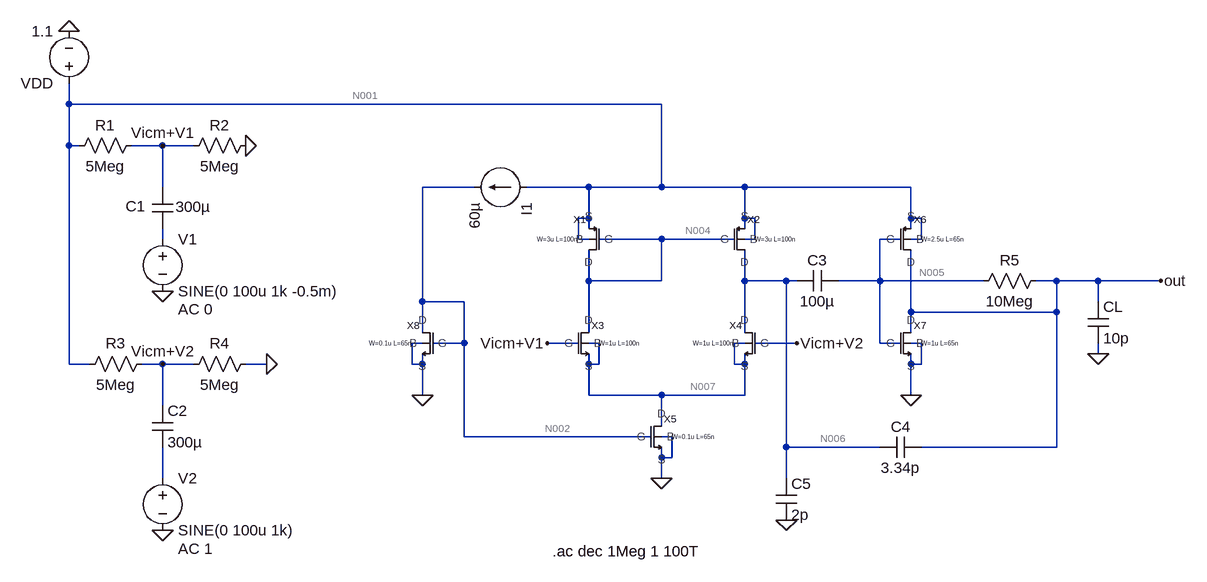
[diagram p0: schematic q1.asc]
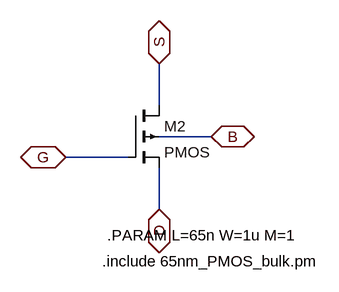
[diagram p1: sub-circuit pmos65.asc]
q1.asc, the LTspice schematic file:
Version 4
SHEET 1 1624 692
WIRE -160 -96 -160 -128
WIRE 752 -96 -160 -96
WIRE -160 -32 -160 -96
WIRE -144 -32 -160 -32
WIRE -16 -32 -64 -32
WIRE 32 -32 -16 -32
WIRE -16 32 -16 -32
WIRE 464 32 384 32
WIRE 640 32 544 32
WIRE 752 32 752 -96
WIRE 752 32 640 32
WIRE 880 32 752 32
WIRE 1136 32 880 32
WIRE 640 80 640 32
WIRE 640 80 624 80
WIRE 880 80 880 32
WIRE 896 80 880 80
WIRE 1136 80 1136 32
WIRE 1152 80 1136 80
WIRE 640 96 640 80
WIRE 880 96 880 80
WIRE 1136 96 1136 80
WIRE -16 112 -16 96
WIRE 624 112 624 80
WIRE 640 112 624 112
WIRE 752 112 656 112
WIRE 864 112 752 112
WIRE 896 112 896 80
WIRE 896 112 880 112
WIRE 1120 112 1088 112
WIRE 1152 112 1152 80
WIRE 1152 112 1136 112
WIRE 640 176 640 128
WIRE 752 176 752 112
WIRE 752 176 640 176
WIRE 880 176 880 128
WIRE 944 176 880 176
WIRE 960 176 944 176
WIRE 1088 176 1088 112
WIRE 1088 176 1024 176
WIRE 1248 176 1088 176
WIRE 1360 176 1328 176
WIRE 1424 176 1360 176
WIRE 1520 176 1424 176
WIRE 384 208 384 32
WIRE 448 208 384 208
WIRE 1424 208 1424 176
WIRE 1136 224 1136 128
WIRE 1360 224 1360 176
WIRE 1360 224 1136 224
WIRE 384 256 384 208
WIRE 640 256 640 176
WIRE 880 256 880 176
WIRE 1136 256 1136 224
WIRE 384 272 368 272
WIRE 448 272 448 208
WIRE 448 272 400 272
WIRE 624 272 576 272
WIRE 656 272 640 272
WIRE 880 272 864 272
WIRE 960 272 896 272
WIRE 1088 272 1088 176
WIRE 1120 272 1088 272
WIRE 1152 272 1136 272
WIRE 1424 288 1424 272
WIRE -160 304 -160 -32
WIRE -128 304 -160 304
WIRE -16 304 -48 304
WIRE 32 304 -16 304
WIRE 144 304 112 304
WIRE 368 304 368 272
WIRE 384 304 384 288
WIRE 384 304 368 304
WIRE 640 304 640 288
WIRE 656 304 656 272
WIRE 656 304 640 304
WIRE 864 304 864 272
WIRE 880 304 880 288
WIRE 880 304 864 304
WIRE 1136 304 1136 288
WIRE 1152 304 1152 272
WIRE 1152 304 1136 304
WIRE 384 352 384 304
WIRE 640 352 640 304
WIRE 752 352 640 352
WIRE 880 352 880 304
WIRE 880 352 752 352
WIRE 1136 352 1136 304
WIRE -16 368 -16 304
WIRE 752 400 752 352
WIRE 448 416 448 272
WIRE 736 416 448 416
WIRE 768 416 752 416
WIRE 944 432 944 176
WIRE 1088 432 944 432
WIRE 1360 432 1360 224
WIRE 1360 432 1152 432
WIRE 752 448 752 432
WIRE 768 448 768 416
WIRE 768 448 752 448
WIRE -16 480 -16 432
WIRE 752 480 752 448
WIRE 944 480 944 432
FLAG 752 480 0
FLAG 1136 352 0
FLAG 1424 288 0
FLAG -16 192 0
FLAG -16 560 0
FLAG 576 272 Vicm+V1
FLAG 960 272 Vicm+V2
FLAG 112 -32 0
FLAG 144 304 0
FLAG -16 -32 Vicm+V1
FLAG -16 304 Vicm+V2
FLAG 384 352 0
FLAG -160 -208 0
FLAG 1520 176 out
FLAG 944 544 0
SYMBOL pmos65 624 112 M0
WINDOW 39 0 0 Left 0
SYMATTR SpiceLine W=3u L=100n
SYMATTR InstName X1
SYMBOL pmos65 896 112 R0
WINDOW 39 0 0 Left 0
SYMATTR SpiceLine W=3u L=100n
SYMATTR InstName X2
SYMBOL nmos65 656 272 R0
WINDOW 39 0 0 Left 0
SYMATTR SpiceLine W=1u L=100n
SYMATTR InstName X3
SYMBOL nmos65 864 272 M0
WINDOW 39 0 0 Left 0
SYMATTR SpiceLine W=1u L=100n
SYMATTR InstName X4
SYMBOL nmos65 768 416 R0
WINDOW 39 0 0 Left 0
SYMATTR SpiceLine W=0.1u L=65n
SYMATTR InstName X5
SYMBOL pmos65 1152 112 R0
WINDOW 39 0 0 Left 0
SYMATTR SpiceLine W=2.5u L=65n
SYMATTR InstName X6
SYMBOL nmos65 1152 272 R0
WINDOW 39 0 0 Left 0
SYMATTR SpiceLine W=1u L=65n
SYMATTR InstName X7
SYMBOL cap 1408 208 R0
SYMATTR InstName CL
SYMATTR Value 10p
SYMBOL voltage -16 96 R0
WINDOW 123 24 124 Left 2
WINDOW 39 0 0 Left 0
SYMATTR Value2 AC 0
SYMATTR InstName V1
SYMATTR Value SINE(0 100u 1k -0.5m)
SYMBOL cap -32 32 R0
WINDOW 0 -41 29 Left 2
WINDOW 3 36 30 Left 2
SYMATTR InstName C1
SYMATTR Value 300µ
SYMBOL res 16 -16 R270
WINDOW 0 32 56 VTop 2
WINDOW 3 0 56 VBottom 2
SYMATTR InstName R2
SYMATTR Value 5Meg
SYMBOL voltage -16 464 R0
WINDOW 123 24 124 Left 2
WINDOW 39 0 0 Left 0
SYMATTR Value2 AC 1
SYMATTR InstName V2
SYMATTR Value SINE(0 100u 1k)
SYMBOL cap -32 368 R0
SYMATTR InstName C2
SYMATTR Value 300µ
SYMBOL res 16 320 R270
WINDOW 0 32 56 VTop 2
WINDOW 3 0 56 VBottom 2
SYMATTR InstName R4
SYMATTR Value 5Meg
SYMBOL res -144 320 R270
WINDOW 0 32 56 VTop 2
WINDOW 3 0 56 VBottom 2
SYMATTR InstName R3
SYMATTR Value 5Meg
SYMBOL res -160 -16 R270
WINDOW 0 32 56 VTop 2
WINDOW 3 0 56 VBottom 2
SYMATTR InstName R1
SYMATTR Value 5Meg
SYMBOL current 544 32 R90
WINDOW 123 0 0 Left 0
WINDOW 39 0 0 Left 0
SYMATTR InstName I1
SYMATTR Value 60µ
SYMBOL nmos65 368 272 M0
WINDOW 39 0 0 Left 0
SYMATTR SpiceLine W=0.1u L=65n
SYMATTR InstName X8
SYMBOL voltage -160 -112 R180
WINDOW 123 0 0 Left 0
WINDOW 39 0 0 Left 0
SYMATTR InstName VDD
SYMATTR Value 1.1
SYMBOL res 1232 192 R270
WINDOW 0 32 56 VTop 2
WINDOW 3 0 56 VBottom 2
SYMATTR InstName R5
SYMATTR Value 10Meg
SYMBOL cap 1024 160 R90
WINDOW 0 0 32 VBottom 2
WINDOW 3 32 32 VTop 2
SYMATTR InstName C3
SYMATTR Value 100µ
SYMBOL cap 1152 416 R90
WINDOW 0 0 32 VBottom 2
WINDOW 3 32 32 VTop 2
SYMATTR InstName C4
SYMATTR Value 3.34p
SYMBOL cap 928 480 R0
SYMATTR InstName C5
SYMATTR Value 2p
TEXT 584 592 Left 2 !.ac dec 1Meg 1 100T

pmos65.asc, the sub-circuit schematic file:
Version 4
SHEET 1 880 680
WIRE 160 80 160 16
WIRE 240 128 160 128
WIRE 112 160 16 160
WIRE 160 240 160 176
FLAG 16 160 G
IOPIN 16 160 BiDir
FLAG 160 240 D
IOPIN 160 240 BiDir
FLAG 160 16 S
IOPIN 160 16 BiDir
FLAG 240 128 B
IOPIN 240 128 BiDir
SYMBOL pmos4 112 80 R0
SYMATTR InstName M2
SYMATTR Value2 l={L} w={W} ad='2*65n*{W}' as='2*65n*{W}' pd='2*(2*65n+{W})' ps='2*(2*65n+{W})' m={M}
TEXT 80 280 Left 2 !.PARAM L=65n W=1u M=1
TEXT 72 320 Left 2 !.include 65nm_PMOS_bulk.pm

The netlist it stands for:
* q1.asc
XX1 N004 N004 N001 N001 pmos65 params: W=3u L=100n
XX2 N004 N006 N001 N001 pmos65 params: W=3u L=100n
XX3 Vicm+V1 N004 N007 N007 nmos65 params: W=1u L=100n  ; pins G D S B
XX4 Vicm+V2 N006 N007 N007 nmos65 params: W=1u L=100n  ; pins G D S B
XX5 N002 N007 0 0 nmos65 params: W=0.1u L=65n  ; pins G D S B
XX6 N005 out N001 N001 pmos65 params: W=2.5u L=65n
XX7 N005 out 0 0 nmos65 params: W=1u L=65n  ; pins G D S B
CL out 0 10p
V1 N003 0 SINE(0 100u 1k -0.5m) AC 0
C1 Vicm+V1 N003 300µ
R2 Vicm+V1 0 5Meg
V2 N008 0 SINE(0 100u 1k) AC 1
C2 Vicm+V2 N008 300µ
R4 Vicm+V2 0 5Meg
R3 N001 Vicm+V2 5Meg
R1 N001 Vicm+V1 5Meg
I1 N001 N002 60µ
XX8 N002 N002 0 0 nmos65 params: W=0.1u L=65n  ; pins G D S B
VDD N001 0 1.1
R5 N005 out 10Meg
C3 N005 N006 100µ
C4 out N006 3.34p
C5 N006 0 2p

* block symbol definitions
.subckt pmos65 G D S B
M2 S G D B PMOS l={L} w={W} ad='2*65n*{W}' as='2*65n*{W}' pd='2*(2*65n+{W})' ps='2*(2*65n+{W})' m={M}
.PARAM L=65n W=1u M=1
.include 65nm_PMOS_bulk.pm
.ends pmos65

.model NMOS NMOS
.model PMOS PMOS
.lib standard.mos
.ac dec 1Meg 1 100T
.backanno
.end

* Results of the author's LTspice run, read from the files saved beside the schematic
* Operating Point, zero values left out:
*   V(n001) = 1.1 V
*   V(n004) = 653.1 mV
*   V(n006) = 653.1 mV
*   V(vicm+v1) = 549.8 mV
*   V(n007) = 127.3 mV
*   V(vicm+v2) = 549.8 mV
*   V(n002) = 805 mV
*   V(n005) = 537.3 mV
*   V(out) = 539.7 mV
*   I(I1) = 60 µA
*   I(R5) = -242 pA
*   I(R1) = 110 nA
*   I(R3) = 110 nA
*   I(R4) = 110 nA
*   I(R2) = 110 nA
*   I(Vdd) = -294.1 µA